# EAGLE schematic GarderOpa (EAGLE 9.3.2)
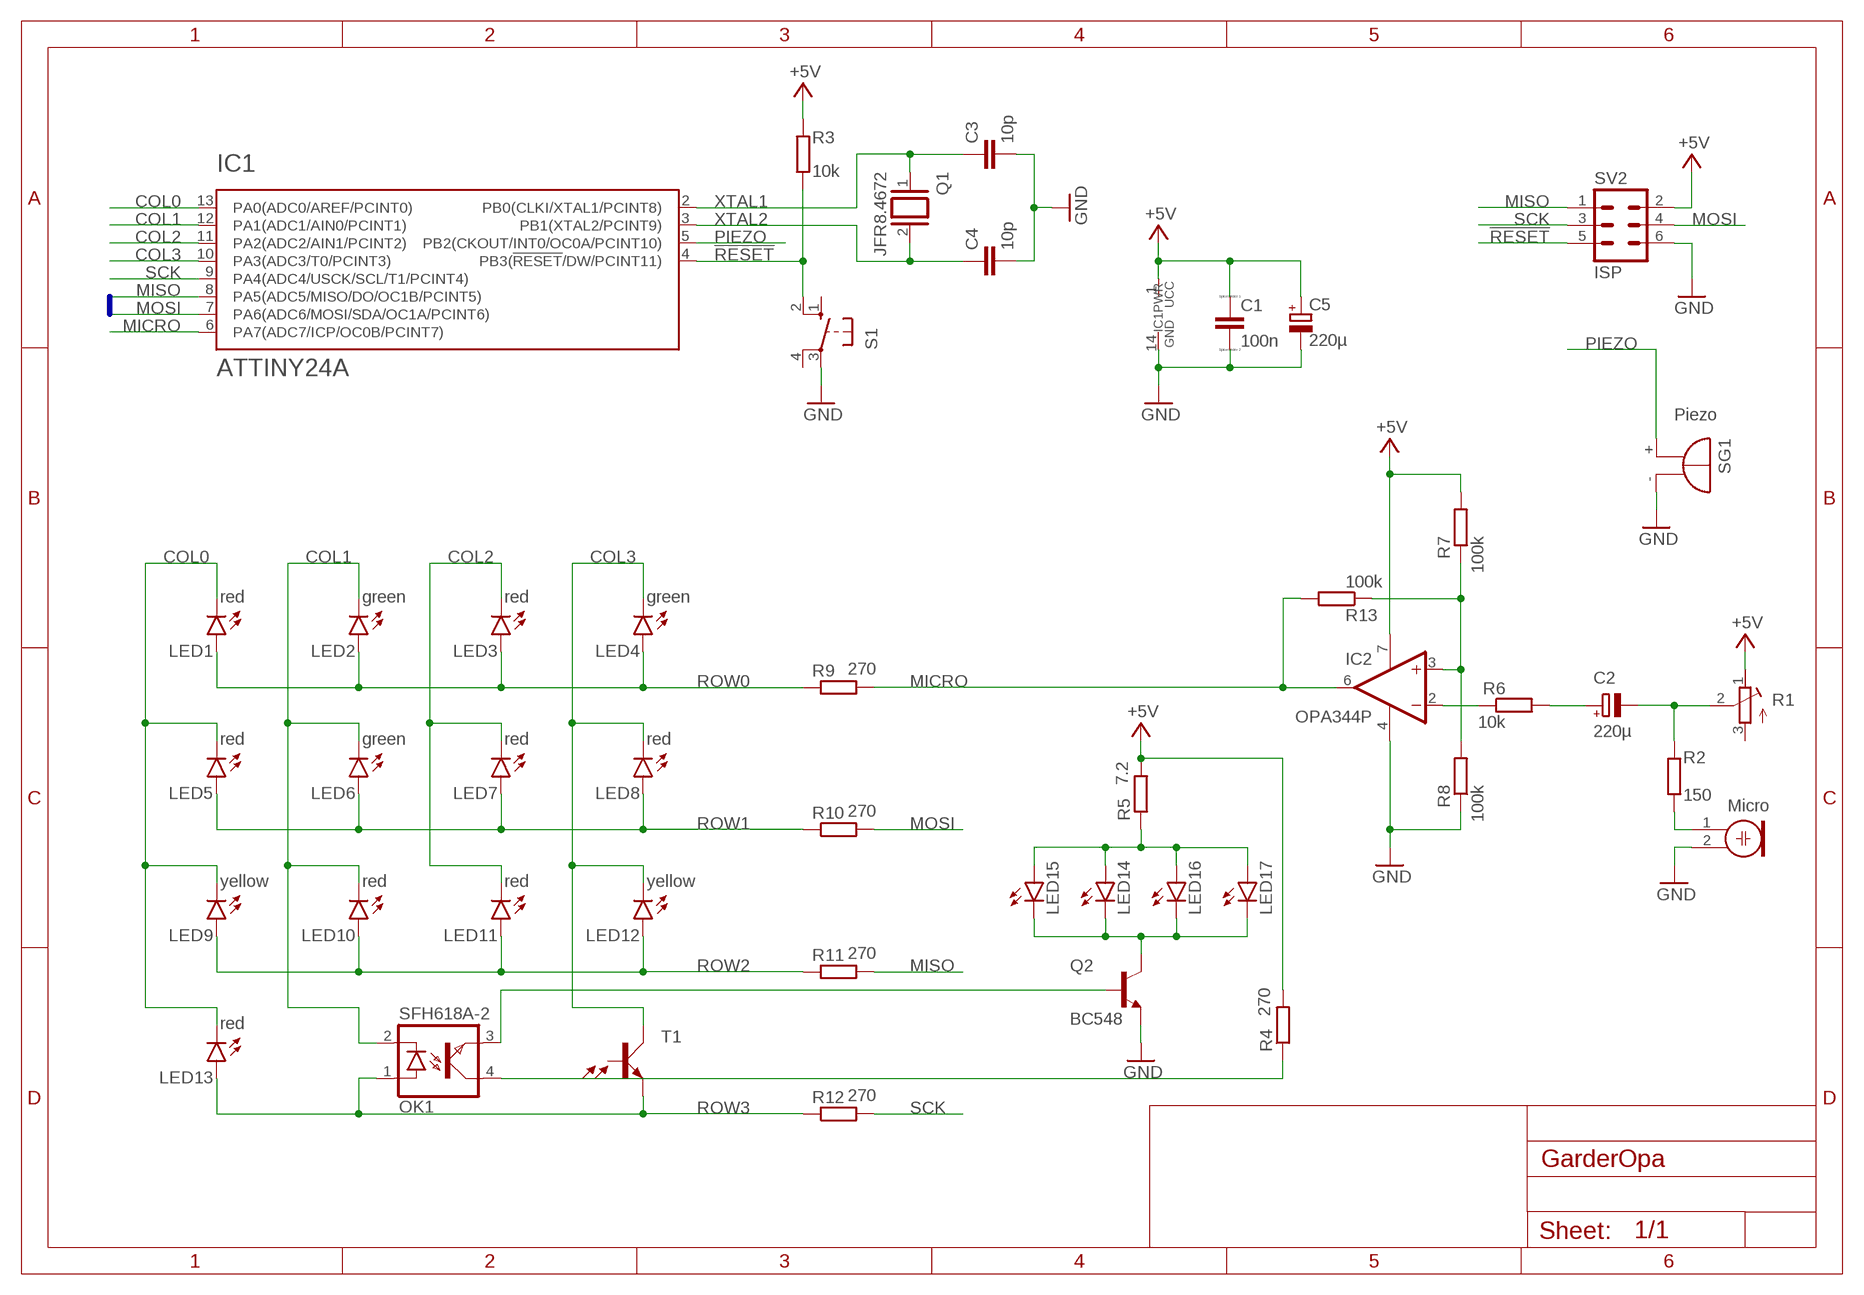
[diagram p0: schematic, sheet 1]

## Parts
C1  100n  CC0603  [C0603]
C2  220µ  CPOL-EUE2-4  [E2-4]
C3  10p  C-EU025-024X044  [C025-024X044]
C4  10p  C-EU025-024X044  [C025-024X044]
C5  220µ  CPOL-EUE2-4  [E2-4]
IC1  ATTINY24A  ATTINY24/44/84-PU  [DIL14]
IC2  OPA344P  [DIL08]
LED1  red  LED3MM  [LED3MM]
LED2  green  LED3MM  [LED3MM]
LED3  red  LED3MM  [LED3MM]
LED4  green  LED3MM  [LED3MM]
LED5  red  LED3MM  [LED3MM]
LED6  green  LED3MM  [LED3MM]
LED7  red  LED3MM  [LED3MM]
LED8  red  LED3MM  [LED3MM]
LED9  yellow  LED3MM  [LED3MM]
LED10  red  LED3MM  [LED3MM]
LED11  red  LED3MM  [LED3MM]
LED12  yellow  LED3MM  [LED3MM]
LED13  red  LED3MM  [LED3MM]
LED14  LED5MM  [LED5MM]
LED15  LED5MM  [LED5MM]
LED16  LED5MM  [LED5MM]
LED17  LED5MM  [LED5MM]
M1  Micro  ELECTRET_MICROPHON-WM-61B  [WM-61B]
OK1  SFH618A-2  [DIP4]
Q1  JFR8.4672  XTAL/S  [QS]
Q2  BC548  [TO92-EBC]
R1  R-TRIMM43P  [RTRIM43P]
R2  150  R-EU_0204/7  [0204/7]
R3  10k  R-EU_R0603  [R0603]
R4  270  R-EU_R0603  [R0603]
R5  7.2  R-EU_R0603  [R0603]
R6  10k  R-EU_0204/7  [0204/7]
R7  100k  R-EU_0204/7  [0204/7]
R8  100k  R-EU_0204/7  [0204/7]
R9  270  R-EU_R0603  [R0603]
R10  270  R-EU_R0603  [R0603]
R11  270  R-EU_R0603  [R0603]
R12  270  R-EU_R0603  [R0603]
R13  100k  R-EU_0204/7  [0204/7]
S1  10-XX  [B3F-10XX]
SG1  Piezo  EB2505  [EB2505]
SV2  ISP  MA03-2  [MA03-2]
T1  SFH303  [SFH303]

## Nets
!RESET: IC1.4(PB3(!RESET!/DW/PCINT11)) R3.1 S1.2(S1) SV2.5
+5V: C1.1 C5.+ IC1.1(UCC) IC2.7(V+) R1.1(E) R3.2 R4.2 R5.2 R7.2 SV2.2
COL0: IC1.13(PA0(ADC0/AREF/PCINT0)) LED1.K(C) LED5.K(C) LED9.K(C) LED13.K(C)
COL1: IC1.12(PA1(ADC1/AIN0/PCINT1)) LED2.K(C) LED6.K(C) LED10.K(C) OK1.2(C)
COL2: IC1.11(PA2(ADC2/AIN1/PCINT2)) LED3.K(C) LED7.K(C) LED11.K(C)
COL3: IC1.10(PA3(ADC3/T0/PCINT3)) LED4.K(C) LED8.K(C) LED12.K(C) T1.2(C)
GND: C1.2 C3.2 C4.2 C5.- IC1.14(GND) IC2.4(V-) M1.2 Q2.E R8.1 S1.3(P) SG1.- SV2.6
MICRO: IC1.6(PA7(ADC7/ICP/OC0B/PCINT7)) IC2.6(OUT) R9.2 R13.2
MISO: IC1.8(PA5(ADC5/MISO/DO/OC1B/PCINT5)) R11.2 SV2.1
MOSI: IC1.7(PA6(ADC6/MOSI/SDA/OC1A/PCINT6)) R10.2 SV2.4
N$1: OK1.3(EMIT) Q2.B
N$2: OK1.4(COL) R4.1
N$3: M1.1 R2.2
N$4: LED14.K(C) LED15.K(C) LED16.K(C) LED17.K(C) Q2.C
N$5: LED14.A LED15.A LED16.A LED17.A R5.1
N$6: C2.- R1.2(S) R2.1
N$7: C2.+ R6.2
N$8: IC2.2(-IN) R6.1
N$9: IC2.3(+IN) R7.1 R8.2 R13.1
PIEZO: IC1.5(PB2(CKOUT/INT0/OC0A/PCINT10)) SG1.+
ROW0: LED1.A LED2.A LED3.A LED4.A R9.1
ROW1: LED5.A LED6.A LED7.A LED8.A R10.1
ROW2: LED9.A LED10.A LED11.A LED12.A R11.1
ROW3: LED13.A OK1.1(A) R12.1 T1.1(E)
SCK: IC1.9(PA4(ADC4/USCK/SCL/T1/PCINT4)) R12.2 SV2.3
XTAL1: C3.1 IC1.2(PB0(CLKI/XTAL1/PCINT8)) Q1.1
XTAL2: C4.1 IC1.3(PB1(XTAL2/PCINT9)) Q1.2
Unconnected: R1.3(A) S1.1(S) S1.4(P1) T1.3(B)

## Buses
SPI:CLK,INT,MISO,MOSI

## Library data of the parts
C1 = eagle-ltspice:C: CAPACITOR, European symbol; SPICEMODEL: NONE; SPICEPREFIX: C
C2 C5 = rcl:CPOL-EU: POLARIZED CAPACITOR, European symbol; SPICEPREFIX: C
C3 C4 = rcl:C-EU: CAPACITOR, European symbol; SPICEPREFIX: C
IC1 = atmel_tiny24-44-84tiny48-88mega48-88-168-328:ATTINY24/44/84
IC2 = linear:OPA*: Single Operational Amplifier Low Power, Single-Supply, Rail-To-Rail Operational Amplifier Source: http://focus.ti.com/lit/ds/symlink/opa2345.pdf
LED1-LED17 = led:LED: LED OSRAM: - CHIPLED LG R971, LG N971, LY N971, LG Q971, LY Q971, LO R971, LY R971 LH N974, LH R974 LS Q976, LO Q976, LY Q976 LO Q996 - Hyper CHIPLED LW Q18S LB Q993, LB Q99A, LB R99A - SideLED LS A670, LO A670, LY A670, LG A670, LP A670 LB A673, LV A673, LT A673, LW A673 LH A674 LY A675 LS A676, LA A676, LO A676, LY A676, LW A676 LS A679, LY A679, LG A679 - Hyper Micro SIDELED® LS Y876, LA Y876, LO Y876, LY Y876 LT Y87S - SmartLED LW L88C, LW L88S LB L89C, LB L89S, LG L890 LS L89K, LO L89K, LY L89K LS L896, LA L896, LO L896, LY L896 - TOPLED LS T670, LO T670, LY T670, LG T670, LP T670 LSG T670, LSP T670, LSY T670, LOP T670, LYG T670 LG T671, LOG T671, LSG T671 LB T673, LV T673, LT T673, LW T673 LH T674 LS T676, LA T676, LO T676, LY T676, LB T676, LH T676, LSB T676, LW T676 LB T67C, LV T67C, LT T67C, LS T67K, LO T67K, LY T67K, LW E67C LS E67B, LA E67B, LO E67B, LY E67B, LB E67C, LV E67C, LT E67C LW T67C LS T679, LY T679, LG T679 LS T770, LO T770, LY T770, LG T770, LP T770 LB T773, LV T773, LT T773, LW T773 LH T774 LS E675, LA E675, LY E675, LS T675 LS T776, LA T776, LO T776, LY T776, LB T776 LHGB T686 LT T68C, LB T68C - Hyper Mini TOPLED® LB M676 - Mini TOPLED Santana® LG M470 LS M47K, LO M47K, LY M47K Source: http://www.osram.convergy.de LUXEON: - LUMILED® LXK2-PW12-R00, LXK2-PW12-S00, LXK2-PW14-U00, LXK2-PW14-V00 LXK2-PM12-R00, LXK2-PM12-S00, LXK2-PM14-U00 LXK2-PE12-Q00, LXK2-PE12-R00, LXK2-PE12-S00, LXK2-PE14-T00, LXK2-PE14-U00 LXK2-PB12-K00, LXK2-PB12-L00, LXK2-PB12-M00, LXK2-PB14-N00, LXK2-PB14-P00, LXK2-PB14-Q00 LXK2-PR12-L00, LXK2-PR12-M00, LXK2-PR14-Q00, LXK2-PR14-R00 LXK2-PD12-Q00, LXK2-PD12-R00, LXK2-PD12-S00 LXK2-PH12-R00, LXK2-PH12-S00 LXK2-PL12-P00, LXK2-PL12-Q00, LXK2-PL12-R00 Source: www.luxeon.com KINGBRIGHT: KA-3528ASYC Source: www.kingbright.com
M1 = microphon:ELECTRET_MICROPHON-: Electret Condenser Microphone; MIC: Micro
OK1 = optocoupler:SFH618?*: Optocoupler, Phototransistor Output, Low Input Current Source: Data sheet <http://www.vishay.com/docs/83673/sfh618.pdf>; MF: VISHAY/TELEFUNKEN; MPN: SFH618A-2; OC_FARNELL: 6424855; OC_NEWARK: 21H7744
Q1 = special:XTAL/S: CRYSTAL
Q2 = transistor-npn:BC548*: NPN Transistor
R1 = rcl:R-TRIMM: Trimm resistor; SPICEMODEL: X; SPICEPREFIXL: POT
R2-R13 = rcl:R-EU_: RESISTOR, European symbol; SPICEPREFIX: R
S1 = switch-omron:10-XX: OMRON SWITCH; MPN: B3F-1000; OC_FARNELL: 176432; OC_NEWARK: 36M3542
SG1 = buzzer:EB2505: BUZZER Source: Buerklin; OC_FARNELL: unknown; OC_NEWARK: unknown
SV2 = con-lstb:MA03-2: PIN HEADER; OC_FARNELL: unknown; OC_NEWARK: unknown
T1 = opto-trans-siemens:SFH303: Silicium NPN Phototransistor Source: Siemens; OC_FARNELL: unknown; OC_NEWARK: unknown